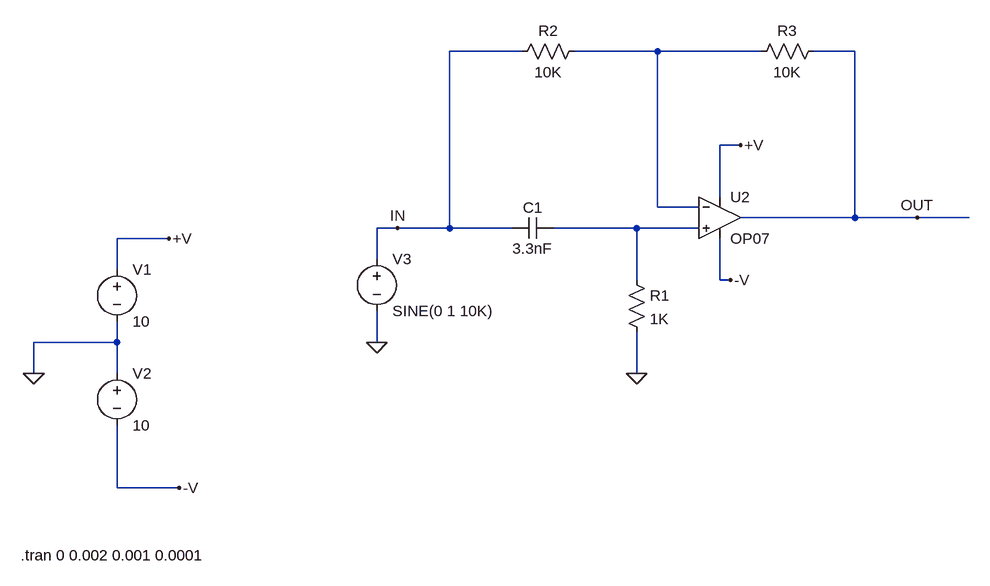
[diagram p0: schematic all-pass.asc]
all-pass.asc, the LTspice schematic file:
Version 4
SHEET 1 1456 680
WIRE 496 -464 384 -464
WIRE 704 -464 576 -464
WIRE 864 -464 704 -464
WIRE 1008 -464 944 -464
WIRE 832 -320 800 -320
WIRE 800 -240 800 -320
WIRE 704 -224 704 -464
WIRE 768 -224 704 -224
WIRE 1008 -208 1008 -464
WIRE 1008 -208 832 -208
WIRE 1104 -208 1008 -208
WIRE 1184 -208 1104 -208
WIRE 304 -192 272 -192
WIRE 384 -192 384 -464
WIRE 384 -192 304 -192
WIRE 480 -192 384 -192
WIRE 672 -192 544 -192
WIRE 768 -192 672 -192
WIRE -48 -176 -128 -176
WIRE 272 -144 272 -192
WIRE -128 -128 -128 -176
WIRE 672 -112 672 -192
WIRE 800 -112 800 -176
WIRE 816 -112 800 -112
WIRE -128 -16 -128 -48
WIRE -128 -16 -256 -16
WIRE 272 -16 272 -64
WIRE -256 32 -256 -16
WIRE -128 32 -128 -16
WIRE 672 32 672 -32
WIRE -128 208 -128 112
WIRE -32 208 -128 208
FLAG -256 32 0
FLAG -48 -176 +V
FLAG 832 -320 +V
FLAG -32 208 -V
FLAG 816 -112 -V
FLAG 672 32 0
FLAG 272 -16 0
FLAG 304 -192 IN
FLAG 1104 -208 OUT
SYMBOL voltage -128 -144 R0
WINDOW 123 0 0 Left 2
WINDOW 39 0 0 Left 2
SYMATTR InstName V1
SYMATTR Value 10
SYMBOL voltage -128 16 R0
WINDOW 123 0 0 Left 2
WINDOW 39 0 0 Left 2
SYMATTR InstName V2
SYMATTR Value 10
SYMBOL Opamps\\OP07 800 -272 R0
SYMATTR InstName U2
SYMBOL cap 544 -208 R90
WINDOW 0 0 32 VBottom 2
WINDOW 3 32 32 VTop 2
SYMATTR InstName C1
SYMATTR Value 3.3nF
SYMBOL res 656 -128 R0
SYMATTR InstName R1
SYMATTR Value 1K
SYMBOL res 592 -480 R90
WINDOW 0 0 56 VBottom 2
WINDOW 3 32 56 VTop 2
SYMATTR InstName R2
SYMATTR Value 10K
SYMBOL res 960 -480 R90
WINDOW 0 0 56 VBottom 2
WINDOW 3 32 56 VTop 2
SYMATTR InstName R3
SYMATTR Value 10K
SYMBOL voltage 272 -160 R0
WINDOW 123 0 0 Left 2
WINDOW 39 0 0 Left 2
SYMATTR InstName V3
SYMATTR Value SINE(0 1 10K)
TEXT -276 312 Left 2 !.tran 0 0.002 0.001 0.0001

The netlist it stands for:
* all-pass.asc
V1 +V 0 10
V2 0 -V 10
XU2 N002 N001 +V -V OUT LT1001  ; OP07, pins In+ In- V+ V- OUT
C1 N002 IN 3.3nF
R1 N002 0 1K
R2 N001 IN 10K
R3 OUT N001 10K
V3 IN 0 SINE(0 1 10K)
.tran 0 0.002 0.001 0.0001
.lib LTC.lib
.backanno
.end